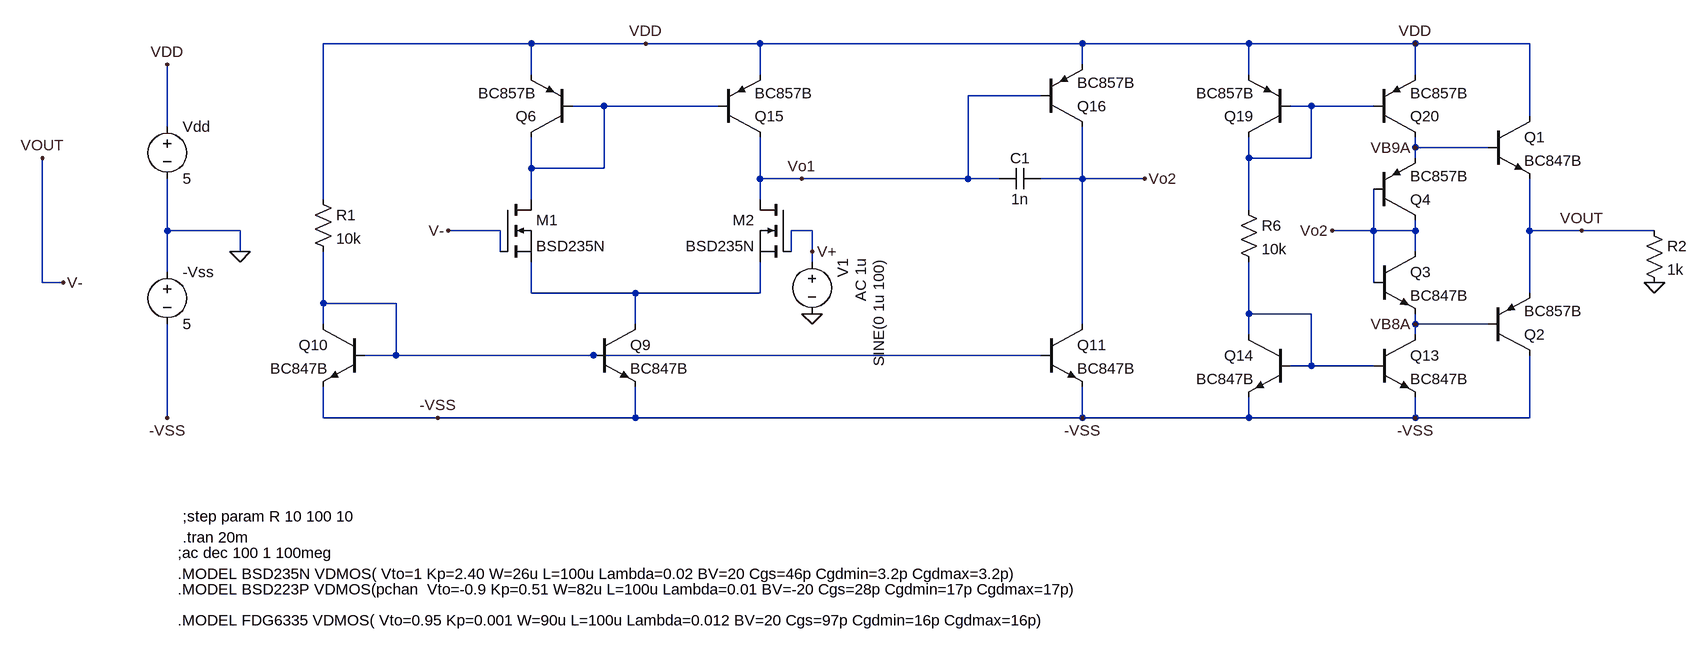
[diagram p0: schematic OpAmp_discreto_4.asc]
OpAmp_discreto_4.asc, the LTspice schematic file:
Version 4
SHEET 1 2688 1260
WIRE 48 -544 -272 -544
WIRE 224 -544 48 -544
WIRE 400 -544 224 -544
WIRE 896 -544 400 -544
WIRE 1152 -544 896 -544
WIRE 1408 -544 1152 -544
WIRE 1584 -544 1408 -544
WIRE 896 -512 896 -544
WIRE 48 -496 48 -544
WIRE 400 -496 400 -544
WIRE 1152 -496 1152 -544
WIRE 1408 -496 1408 -544
WIRE 832 -464 720 -464
WIRE 160 -448 112 -448
WIRE 336 -448 160 -448
WIRE 1248 -448 1216 -448
WIRE 1344 -448 1248 -448
WIRE 1584 -432 1584 -544
WIRE -512 -416 -512 -512
WIRE 1408 -384 1408 -400
WIRE 1520 -384 1408 -384
WIRE 1152 -368 1152 -400
WIRE 1248 -368 1248 -448
WIRE 1248 -368 1152 -368
WIRE 1408 -368 1408 -384
WIRE 48 -352 48 -400
WIRE 160 -352 160 -448
WIRE 160 -352 48 -352
WIRE 400 -336 400 -400
WIRE 464 -336 400 -336
WIRE 720 -336 720 -464
WIRE 720 -336 464 -336
WIRE 768 -336 720 -336
WIRE 896 -336 896 -416
WIRE 896 -336 832 -336
WIRE 992 -336 896 -336
WIRE -272 -304 -272 -544
WIRE 48 -304 48 -352
WIRE 400 -304 400 -336
WIRE 1152 -288 1152 -368
WIRE -512 -256 -512 -336
WIRE -400 -256 -512 -256
WIRE 0 -256 -80 -256
WIRE 480 -256 448 -256
WIRE 1344 -256 1344 -320
WIRE 1344 -256 1280 -256
WIRE 1408 -256 1408 -272
WIRE 1408 -256 1344 -256
WIRE 1584 -256 1584 -336
WIRE 1664 -256 1584 -256
WIRE 1776 -256 1664 -256
WIRE -400 -224 -400 -256
WIRE 0 -224 0 -256
WIRE 448 -224 448 -256
WIRE 480 -224 480 -256
WIRE 1408 -224 1408 -256
WIRE 480 -208 480 -224
WIRE -512 -192 -512 -256
WIRE -704 -176 -704 -368
WIRE -672 -176 -704 -176
WIRE 1344 -176 1344 -256
WIRE 48 -160 48 -208
WIRE 208 -160 48 -160
WIRE 400 -160 400 -208
WIRE 400 -160 208 -160
WIRE 1584 -160 1584 -256
WIRE -272 -144 -272 -224
WIRE -160 -144 -272 -144
WIRE 1152 -128 1152 -208
WIRE 1248 -128 1152 -128
WIRE -272 -112 -272 -144
WIRE 208 -112 208 -160
WIRE 896 -112 896 -336
WIRE 1408 -112 1408 -128
WIRE 1520 -112 1408 -112
WIRE 1152 -96 1152 -128
WIRE 1408 -96 1408 -112
WIRE -160 -64 -160 -144
WIRE -160 -64 -208 -64
WIRE 144 -64 -160 -64
WIRE 832 -64 144 -64
WIRE 1248 -48 1248 -128
WIRE 1248 -48 1216 -48
WIRE 1344 -48 1248 -48
WIRE -512 32 -512 -112
WIRE -272 32 -272 -16
WIRE -96 32 -272 32
WIRE 208 32 208 -16
WIRE 208 32 -96 32
WIRE 896 32 896 -16
WIRE 896 32 208 32
WIRE 1152 32 1152 0
WIRE 1152 32 896 32
WIRE 1408 32 1408 0
WIRE 1408 32 1152 32
WIRE 1584 32 1584 -64
WIRE 1584 32 1408 32
FLAG -400 -224 0
FLAG -512 -512 VDD
FLAG -512 32 -VSS
FLAG 1408 -544 VDD
FLAG 1408 32 -VSS
FLAG 992 -336 Vo2
FLAG 1664 -256 VOUT
FLAG 1280 -256 Vo2
FLAG 896 32 -VSS
FLAG 224 -544 VDD
FLAG -96 32 -VSS
FLAG 464 -336 Vo1
FLAG 480 -224 V+
FLAG -80 -256 V-
FLAG -704 -368 VOUT
FLAG -672 -176 V-
FLAG 480 -128 0
FLAG 1776 -176 0
FLAG 1408 -384 VB9A
FLAG 1408 -112 VB8A
SYMBOL res -288 -320 R0
SYMATTR InstName R1
SYMATTR Value 10k
SYMBOL voltage 480 -224 R0
WINDOW 123 75 11 VRight 2
WINDOW 39 0 0 Left 0
WINDOW 0 47 11 VRight 2
WINDOW 3 103 11 VRight 2
SYMATTR Value2 AC 1u
SYMATTR InstName V1
SYMATTR Value SINE(0 1u 100)
SYMBOL voltage -512 -432 R0
WINDOW 123 0 0 Left 0
WINDOW 39 0 0 Left 0
SYMATTR InstName Vdd
SYMATTR Value 5
SYMBOL voltage -512 -208 R0
WINDOW 123 0 0 Left 0
WINDOW 39 0 0 Left 0
SYMATTR InstName -Vss
SYMATTR Value 5
SYMBOL res 1136 -304 R0
SYMATTR InstName R6
SYMATTR Value 10k
SYMBOL npn 1520 -432 R0
SYMATTR InstName Q1
SYMATTR Value BC847B
SYMBOL pnp 1520 -64 M180
SYMATTR InstName Q2
SYMATTR Value BC857B
SYMBOL npn 1344 -224 R0
SYMATTR InstName Q3
SYMATTR Value BC847B
SYMBOL pnp 1344 -272 M180
SYMATTR InstName Q4
SYMATTR Value BC857B
SYMBOL npn -208 -112 M0
SYMATTR InstName Q10
SYMATTR Value BC847B
SYMBOL npn 1344 -96 R0
SYMATTR InstName Q13
SYMATTR Value BC847B
SYMBOL npn 1216 -96 M0
SYMATTR InstName Q14
SYMATTR Value BC847B
SYMBOL pnp 112 -400 R180
SYMATTR InstName Q6
SYMATTR Value BC857B
SYMBOL pnp 336 -400 M180
SYMATTR InstName Q15
SYMATTR Value BC857B
SYMBOL pnp 832 -416 M180
SYMATTR InstName Q16
SYMATTR Value BC857B
SYMBOL pnp 1216 -400 R180
SYMATTR InstName Q19
SYMATTR Value BC857B
SYMBOL pnp 1344 -400 M180
SYMATTR InstName Q20
SYMATTR Value BC857B
SYMBOL npn 144 -112 R0
SYMATTR InstName Q9
SYMATTR Value BC847B
SYMBOL npn 832 -112 R0
SYMATTR InstName Q11
SYMATTR Value BC847B
SYMBOL cap 832 -352 R90
WINDOW 0 0 32 VBottom 2
WINDOW 3 32 32 VTop 2
SYMATTR InstName C1
SYMATTR Value 1n
SYMBOL nmos 0 -304 R0
SYMATTR InstName M1
SYMATTR Value BSD235N
SYMBOL nmos 448 -304 M0
SYMATTR InstName M2
SYMATTR Value BSD235N
SYMBOL res 1760 -272 R0
SYMATTR InstName R2
SYMATTR Value 1k
TEXT -496 240 Left 2 !;ac dec 100 1 100meg
TEXT -496 272 Left 2 !.MODEL BSD235N VDMOS( Vto=1 Kp=2.40 W=26u L=100u Lambda=0.02 BV=20 Cgs=46p Cgdmin=3.2p Cgdmax=3.2p)
TEXT -496 296 Left 2 !.MODEL BSD223P VDMOS(pchan  Vto=-0.9 Kp=0.51 W=82u L=100u Lambda=0.01 BV=-20 Cgs=28p Cgdmin=17p Cgdmax=17p)
TEXT -496 344 Left 2 !.MODEL FDG6335 VDMOS( Vto=0.95 Kp=0.001 W=90u L=100u Lambda=0.012 BV=20 Cgs=97p Cgdmin=16p Cgdmax=16p)
TEXT -488 216 Left 2 !.tran 20m
TEXT -488 184 Left 2 !;step param R 10 100 10

The netlist it stands for:
* OpAmp_discreto_4.asc
R1 VDD N004 10k
V1 V+ 0 SINE(0 1u 100) AC 1u
Vdd VDD 0 5
V§-Vss 0 -VSS 5
R6 N002 N005 10k
Q1 VDD VB9A V- 0 BC847B
Q2 -VSS VB8A V- 0 BC857B
Q3 Vo2 Vo2 VB8A 0 BC847B
Q4 Vo2 Vo2 VB9A 0 BC857B
Q10 N004 N004 -VSS 0 BC847B
Q13 VB8A N005 -VSS 0 BC847B
Q14 N005 N005 -VSS 0 BC847B
Q6 N001 N001 VDD 0 BC857B
Q15 Vo1 N001 VDD 0 BC857B
Q16 Vo2 Vo1 VDD 0 BC857B
Q19 N002 N002 VDD 0 BC857B
Q20 VB9A N002 VDD 0 BC857B
Q9 N003 N004 -VSS 0 BC847B
Q11 Vo2 N004 -VSS 0 BC847B
C1 Vo2 Vo1 1n
M1 N001 V- N003 N003 BSD235N
M2 Vo1 V+ N003 N003 BSD235N
R2 V- 0 1k
.model NPN NPN
.model PNP PNP
.lib standard.bjt
.model NMOS NMOS
.model PMOS PMOS
.lib standard.mos
;ac dec 100 1 100meg
.MODEL BSD235N VDMOS( Vto=1 Kp=2.40 W=26u L=100u Lambda=0.02 BV=20 Cgs=46p Cgdmin=3.2p Cgdmax=3.2p)
.MODEL BSD223P VDMOS(pchan  Vto=-0.9 Kp=0.51 W=82u L=100u Lambda=0.01 BV=-20 Cgs=28p Cgdmin=17p Cgdmax=17p)
.MODEL FDG6335 VDMOS( Vto=0.95 Kp=0.001 W=90u L=100u Lambda=0.012 BV=20 Cgs=97p Cgdmin=16p Cgdmax=16p)
.tran 20m
;step param R 10 100 10
.backanno
.end